# EAGLE design PC03 (EAGLE 9.6.2)
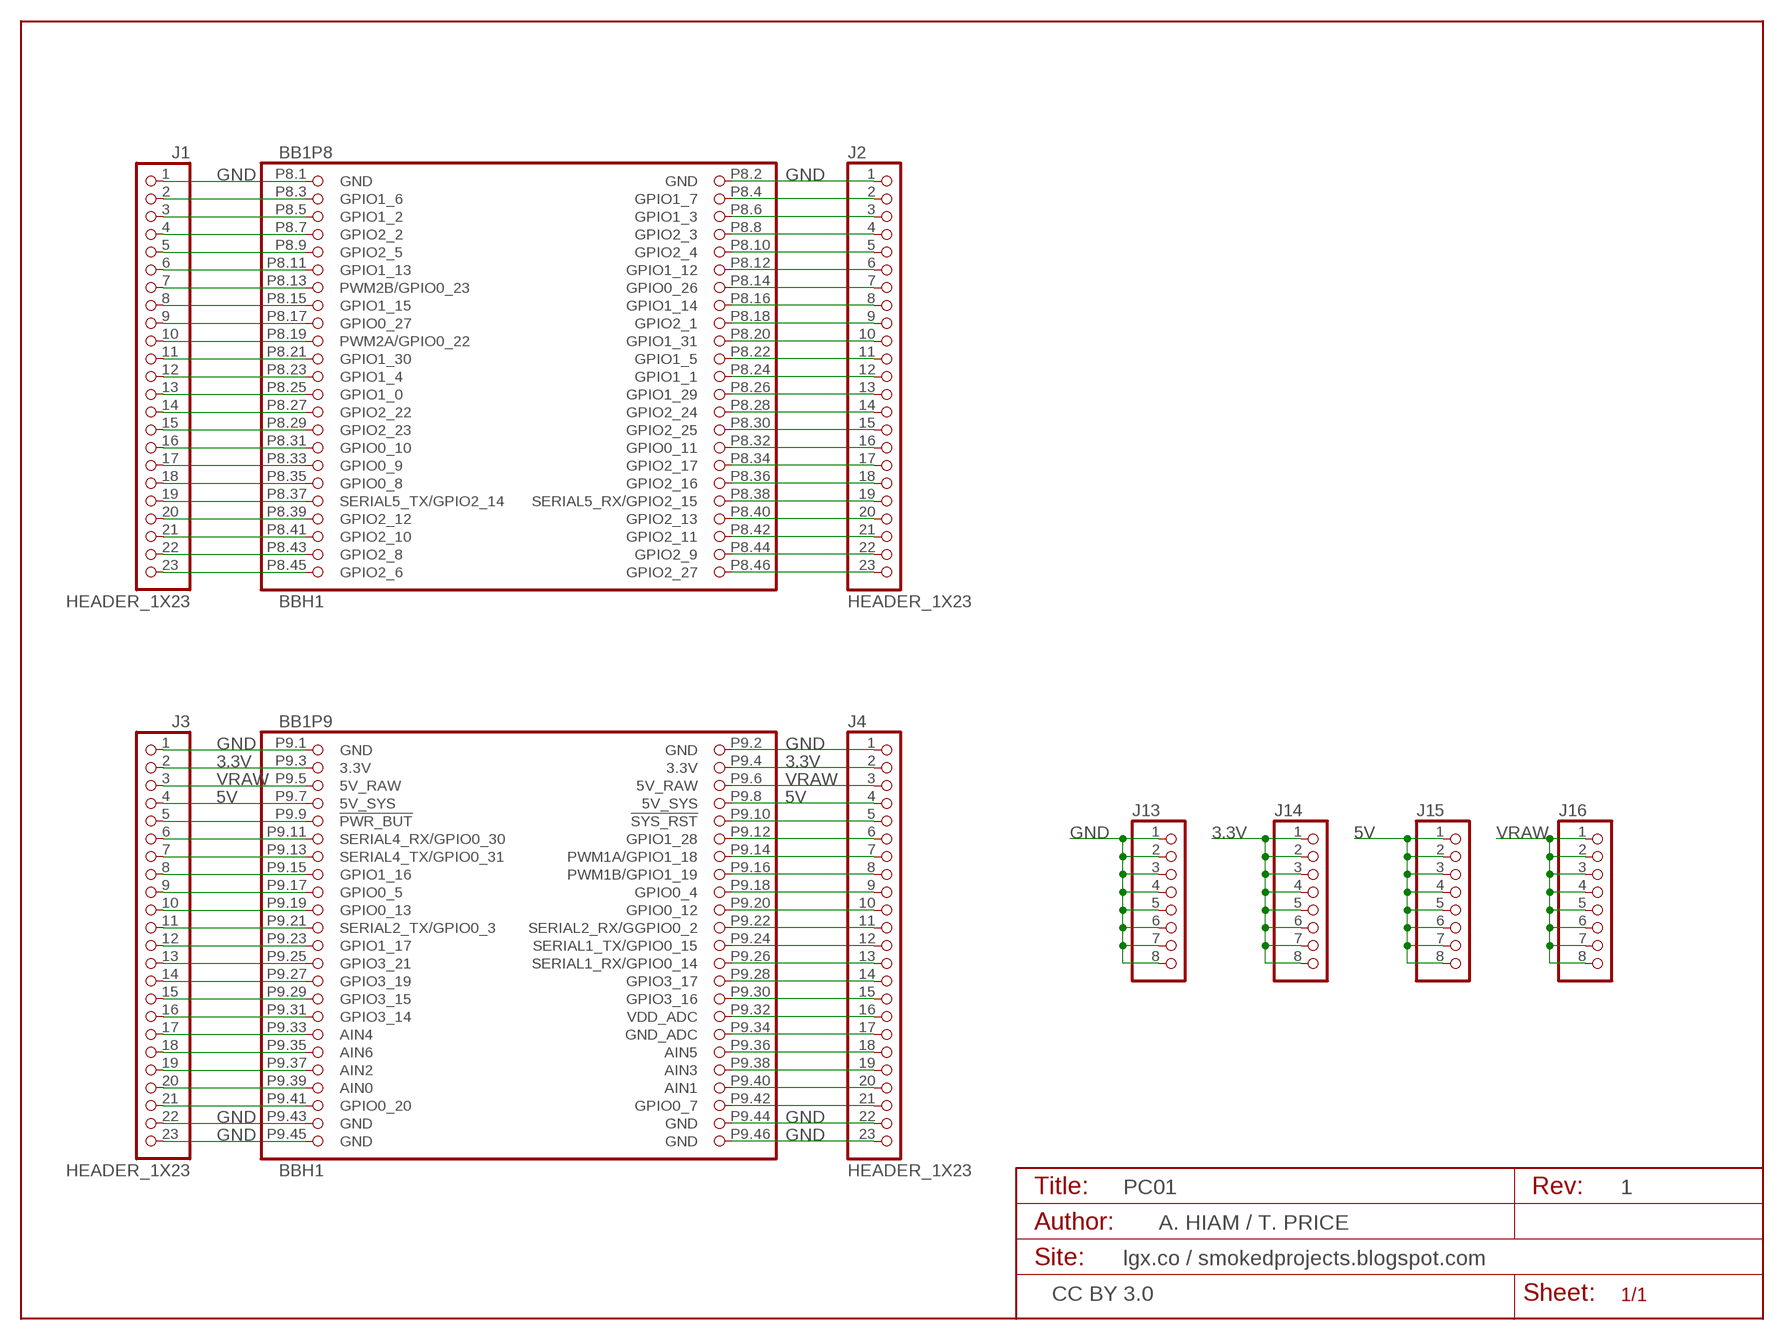
[diagram p0: schematic, sheet 1]

## Parts
BB1  BBH1  [BB_CAPE]
J1  HEADER_1X23  [HEADER_1X23]
J2  HEADER_1X23  [HEADER_1X23]
J3  HEADER_1X23  [HEADER_1X23]
J4  HEADER_1X23  [HEADER_1X23]
J13  HEADER_1X8  [HEADER_1X8]
J14  HEADER_1X8  [HEADER_1X8]
J15  HEADER_1X8  [HEADER_1X8]
J16  HEADER_1X8  [HEADER_1X8]

## Nets
3.3V: BB1.P9.3(P9:3.3V) BB1.P9.4(P9:3.3V) J3.2 J4.2 J14.1 J14.2 J14.3 J14.4 J14.5 J14.6 J14.7 J14.8
5V: BB1.P9.7(P9:5V_SYS) BB1.P9.8(P9:5V_SYS) J3.4 J4.4 J15.1 J15.2 J15.3 J15.4 J15.5 J15.6 J15.7 J15.8
GND: BB1.P8.1(P8:GND) BB1.P8.2(P8:GND) BB1.P9.1(P9:GND) BB1.P9.2(P9:GND) BB1.P9.43(P9:GND) BB1.P9.44(P9:GND) BB1.P9.45(P9:GND) BB1.P9.46(P9:GND) J1.1 J2.1 J3.1 J3.22 J3.23 J4.1 J4.22 J4.23 J13.1 J13.2 J13.3 J13.4 J13.5 J13.6 J13.7 J13.8
N$2: BB1.P8.4(P8:GPIO1_7) J2.2
N$3: BB1.P8.6(P8:GPIO1_3) J2.3
N$4: BB1.P8.8(P8:GPIO2_3) J2.4
N$5: BB1.P8.10(P8:GPIO2_4) J2.5
N$6: BB1.P8.12(P8:GPIO1_12) J2.6
N$7: BB1.P8.14(P8:GPIO0_26) J2.7
N$8: BB1.P8.16(P8:GPIO1_14) J2.8
N$9: BB1.P8.18(P8:GPIO2_1) J2.9
N$10: BB1.P8.20(P8:GPIO1_31) J2.10
N$11: BB1.P8.22(P8:GPIO1_5) J2.11
N$12: BB1.P8.24(P8:GPIO1_1) J2.12
N$13: BB1.P8.26(P8:GPIO1_29) J2.13
N$14: BB1.P8.28(P8:GPIO2_24) J2.14
N$15: BB1.P8.30(P8:GPIO2_25) J2.15
N$16: BB1.P8.32(P8:GPIO0_11) J2.16
N$17: BB1.P8.34(P8:GPIO2_17) J2.17
N$18: BB1.P8.36(P8:GPIO2_16) J2.18
N$19: BB1.P8.38(P8:SERIAL5_RX/GPIO2_15) J2.19
N$20: BB1.P8.40(P8:GPIO2_13) J2.20
N$21: BB1.P8.42(P8:GPIO2_11) J2.21
N$22: BB1.P8.44(P8:GPIO2_9) J2.22
N$23: BB1.P8.46(P8:GPIO2_27) J2.23
N$24: BB1.P8.45(P8:GPIO2_6) J1.23
N$25: BB1.P8.43(P8:GPIO2_8) J1.22
N$26: BB1.P8.41(P8:GPIO2_10) J1.21
N$27: BB1.P8.39(P8:GPIO2_12) J1.20
N$28: BB1.P8.37(P8:SERIAL5_TX/GPIO2_14) J1.19
N$29: BB1.P8.35(P8:GPIO0_8) J1.18
N$30: BB1.P8.33(P8:GPIO0_9) J1.17
N$31: BB1.P8.31(P8:GPIO0_10) J1.16
N$32: BB1.P8.29(P8:GPIO2_23) J1.15
N$33: BB1.P8.27(P8:GPIO2_22) J1.14
N$34: BB1.P8.25(P8:GPIO1_0) J1.13
N$35: BB1.P8.23(P8:GPIO1_4) J1.12
N$36: BB1.P8.21(P8:GPIO1_30) J1.11
N$37: BB1.P8.19(P8:PWM2A/GPIO0_22) J1.10
N$38: BB1.P8.17(P8:GPIO0_27) J1.9
N$39: BB1.P8.15(P8:GPIO1_15) J1.8
N$40: BB1.P8.13(P8:PWM2B/GPIO0_23) J1.7
N$41: BB1.P8.11(P8:GPIO1_13) J1.6
N$42: BB1.P8.9(P8:GPIO2_5) J1.5
N$43: BB1.P8.7(P8:GPIO2_2) J1.4
N$44: BB1.P8.5(P8:GPIO1_2) J1.3
N$45: BB1.P8.3(P8:GPIO1_6) J1.2
N$49: BB1.P9.41(P9:GPIO0_20) J3.21
N$50: BB1.P9.39(P9:AIN0) J3.20
N$51: BB1.P9.37(P9:AIN2) J3.19
N$52: BB1.P9.35(P9:AIN6) J3.18
N$53: BB1.P9.33(P9:AIN4) J3.17
N$54: BB1.P9.31(P9:GPIO3_14) J3.16
N$55: BB1.P9.29(P9:GPIO3_15) J3.15
N$56: BB1.P9.27(P9:GPIO3_19) J3.14
N$57: BB1.P9.25(P9:GPIO3_21) J3.13
N$58: BB1.P9.23(P9:GPIO1_17) J3.12
N$59: BB1.P9.21(P9:SERIAL2_TX/GPIO0_3) J3.11
N$60: BB1.P9.19(P9:GPIO0_13) J3.10
N$61: BB1.P9.17(P9:GPIO0_5) J3.9
N$62: BB1.P9.15(P9:GPIO1_16) J3.8
N$63: BB1.P9.13(P9:SERIAL4_TX/GPIO0_31) J3.7
N$64: BB1.P9.11(P9:SERIAL4_RX/GPIO0_30) J3.6
N$65: BB1.P9.9(P9:!PWR_BUT) J3.5
N$74: BB1.P9.10(P9:!SYS_RST) J4.5
N$75: BB1.P9.12(P9:GPIO1_28) J4.6
N$76: BB1.P9.14(P9:PWM1A/GPIO1_18) J4.7
N$77: BB1.P9.16(P9:PWM1B/GPIO1_19) J4.8
N$78: BB1.P9.18(P9:GPIO0_4) J4.9
N$79: BB1.P9.20(P9:GPIO0_12) J4.10
N$80: BB1.P9.22(P9:SERIAL2_RX/GGPIO0_2) J4.11
N$81: BB1.P9.24(P9:SERIAL1_TX/GPIO0_15) J4.12
N$82: BB1.P9.26(P9:SERIAL1_RX/GPIO0_14) J4.13
N$83: BB1.P9.28(P9:GPIO3_17) J4.14
N$84: BB1.P9.30(P9:GPIO3_16) J4.15
N$85: BB1.P9.32(P9:VDD_ADC) J4.16
N$86: BB1.P9.34(P9:GND_ADC) J4.17
N$87: BB1.P9.36(P9:AIN5) J4.18
N$88: BB1.P9.38(P9:AIN3) J4.19
N$89: BB1.P9.40(P9:AIN1) J4.20
N$90: BB1.P9.42(P9:GPIO0_7) J4.21
VRAW: BB1.P9.5(P9:5V_RAW) BB1.P9.6(P9:5V_RAW) J3.3 J4.3 J16.1 J16.2 J16.3 J16.4 J16.5 J16.6 J16.7 J16.8

## Notes on the sheet
- PC01 | 1
- A. HIAM / T. PRICE
- lgx.co / smokedprojects.blogspot.com
- CC BY 3.0

## Library data of the parts
BB1 = logic-supply:BBH: BeagleBone header sub-assembly; PARTNO: BBH1
J1-J4 = logic-supply:HEADER_1X23
J13-J16 = logic-supply:HEADER_1X8

## Board
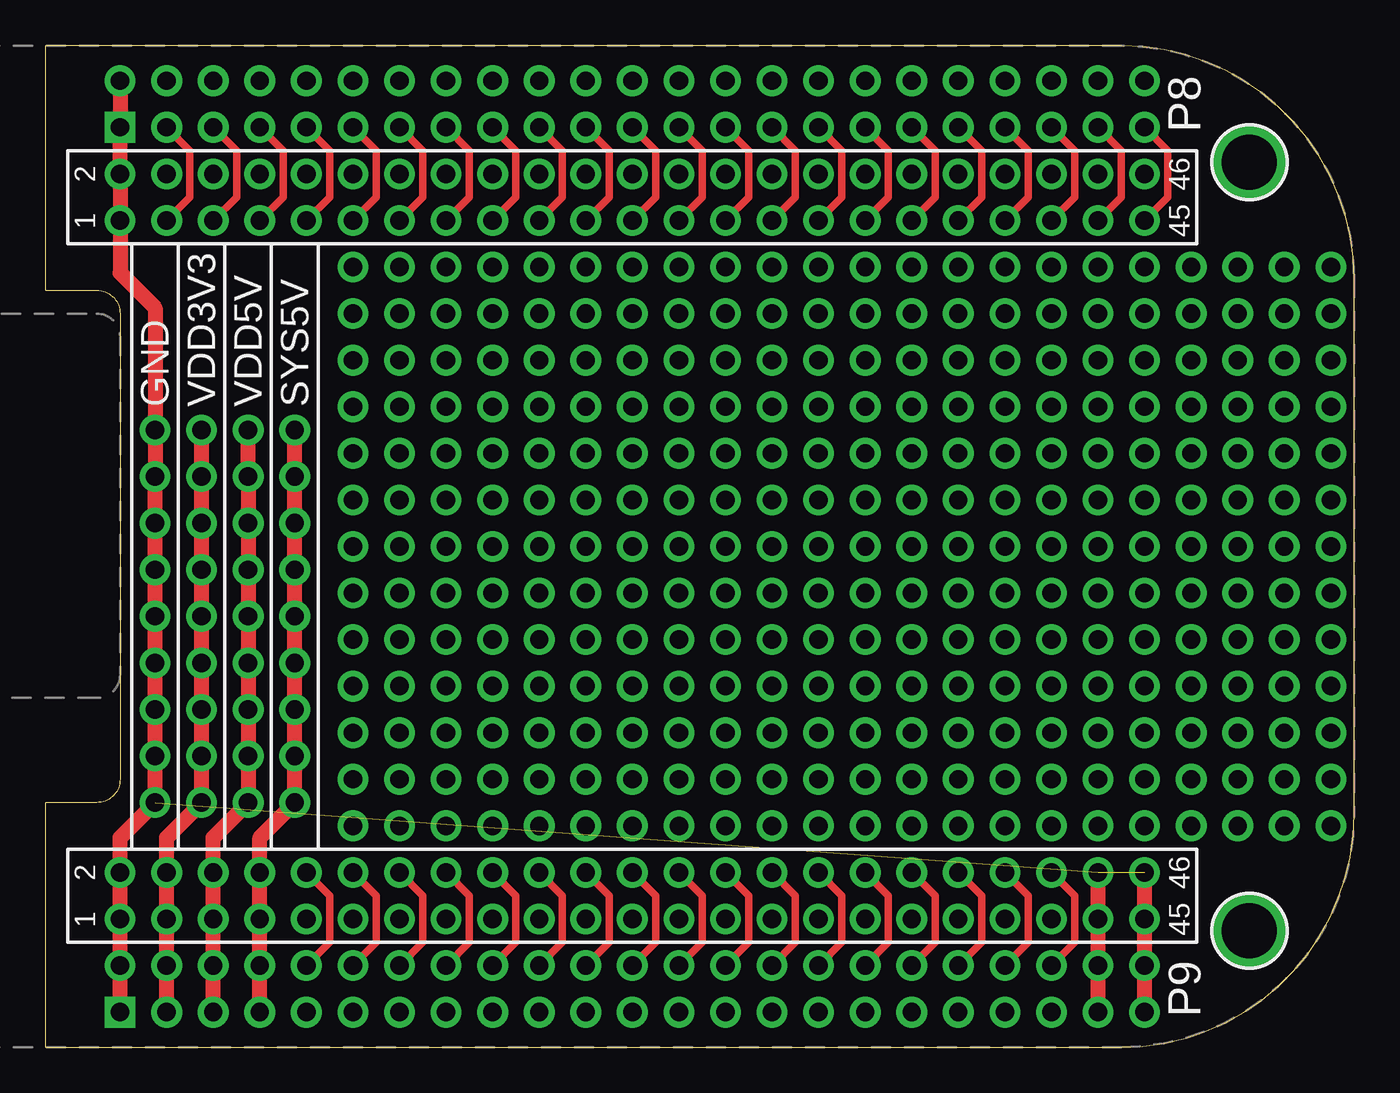
[diagram p1: board, top side]
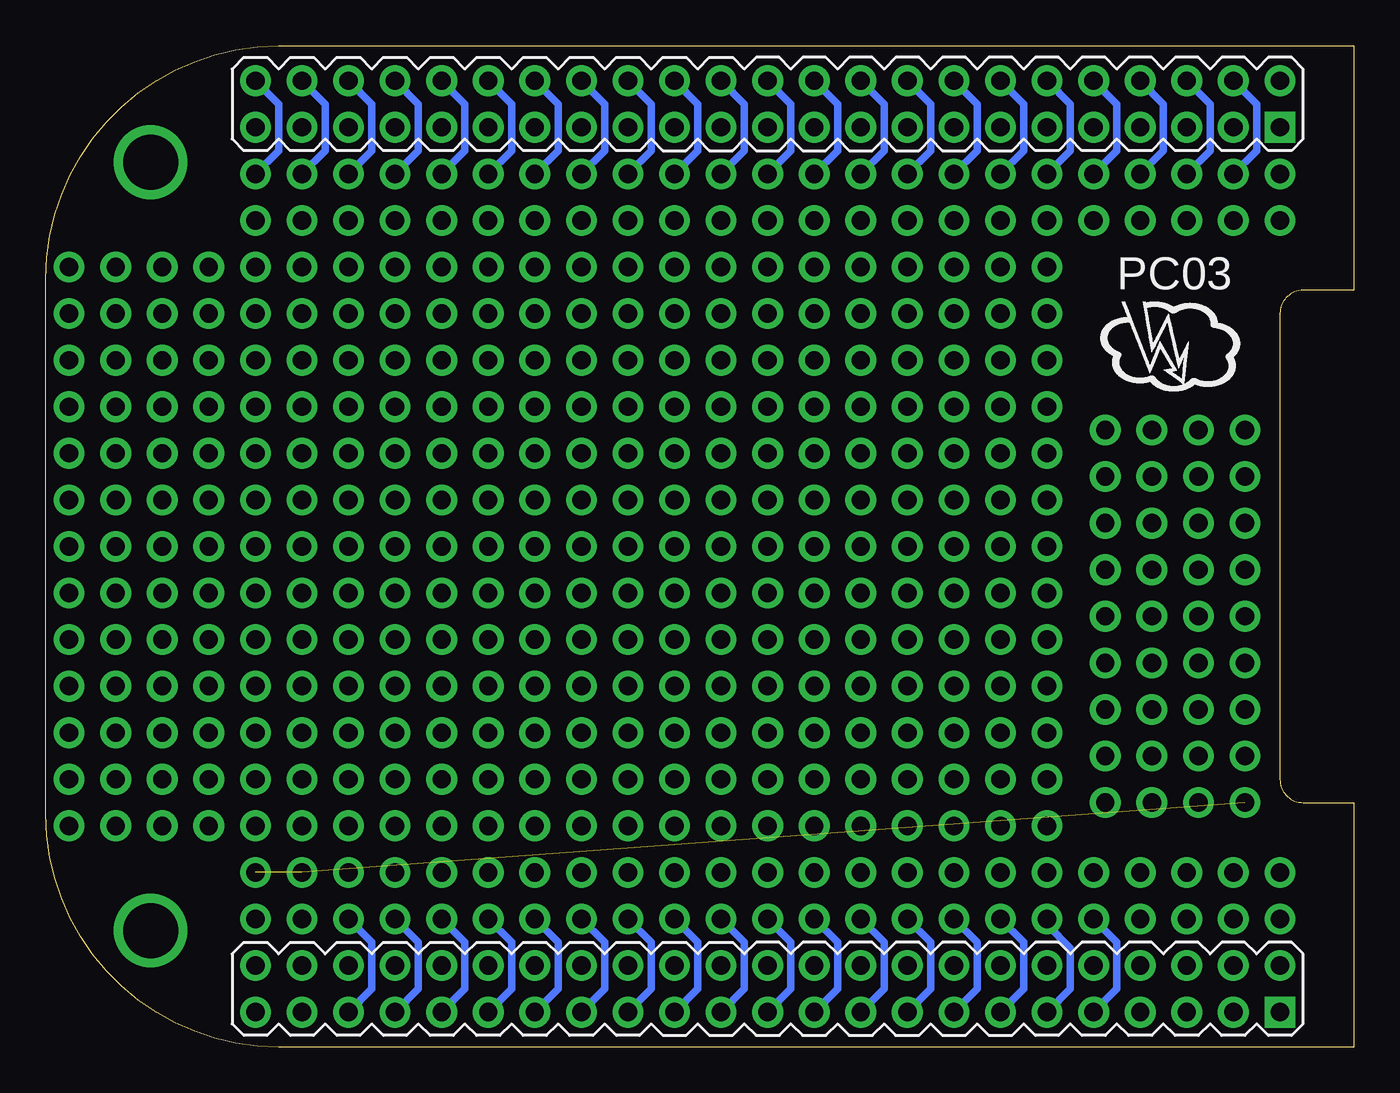
[diagram p2: board, bottom side, seen from below]

Size 71.36 x 54.61 mm. Coordinates in mm from the lower left corner, seen from the top.
Outline: 2.78,41.27 arc-90 4.05,40.01 4.05,14.61 arc-90 2.78,13.34 0,13.34 0,0 58.66,0 arc90 71.36,12.7 71.36,41.91 arc90 58.66,54.61 0,54.61 0,41.27 2.78,41.27
Outline: 2.78,41.27 2.79,41.27
Copper layers (1*16): Top 0.035mm / dielectric 1.5mm / Bottom 0.035mm
Design rules "Fusion_eagle_rule_v1.1": minimum track width 6mil, minimum drill 12mil, track to track 6mil, track to pad 6mil, pad to pad 6mil, via to via 6mil, smd to smd 0mil, copper to edge 10mil, drill to drill 10mil, minimum pad ring 10mil, minimum via ring 6mil, stop-mask expansion 2mil, vias tented up to drill 100mil, thermal gap 10mil

### Footprints (pad centres in the part's own frame; a part is rotated, then mirrored left to right if it is on the bottom)
BB_CAPE = drill 1 pad 1.676 square: P8.1 4.445,19.05; P9.1 52.705,19.05 | drill 1 pad 1.676: P8.2 1.905,19.05; P8.3 4.445,21.59; P8.4 1.905,21.59; P8.5 4.445,24.13; P8.6 1.905,24.13; P8.7 4.445,26.67; P8.8 1.905,26.67; P8.9 4.445,29.21; P8.10 1.905,29.21; P8.11 4.445,31.75; P8.12 1.905,31.75; P8.13 4.445,34.29; P8.14 1.905,34.29; P8.15 4.445,36.83; P8.16 1.905,36.83; P8.17 4.445,39.37; P8.18 1.905,39.37; P8.19 4.445,41.91; P8.20 1.905,41.91; P8.21 4.445,44.45; P8.22 1.905,44.45; P8.23 4.445,46.99; P8.24 1.905,46.99; P8.25 4.445,49.53; P8.26 1.905,49.53; P8.27 4.445,52.07; P8.28 1.905,52.07; P8.29 4.445,54.61; P8.30 1.905,54.61; P8.31 4.445,57.15; P8.32 1.905,57.15; P8.33 4.445,59.69; P8.34 1.905,59.69; P8.35 4.445,62.23; P8.36 1.905,62.23; P8.37 4.445,64.77; P8.38 1.905,64.77; P8.39 4.445,67.31; P8.40 1.905,67.31; P8.41 4.445,69.85; P8.42 1.905,69.85; P8.43 4.445,72.39; P8.44 1.905,72.39; P8.45 4.445,74.93; P8.46 1.905,74.93; P9.2 50.165,19.05; P9.3 52.705,21.59; P9.4 50.165,21.59; P9.5 52.705,24.13; P9.6 50.165,24.13; P9.7 52.705,26.67; P9.8 50.165,26.67; P9.9 52.705,29.21; P9.10 50.165,29.21; P9.11 52.705,31.75; P9.12 50.165,31.75; P9.13 52.705,34.29; P9.14 50.165,34.29; P9.15 52.705,36.83; P9.16 50.165,36.83; P9.17 52.705,39.37; P9.18 50.165,39.37; P9.19 52.705,41.91; P9.20 50.165,41.91; P9.21 52.705,44.45; P9.22 50.165,44.45; P9.23 52.705,46.99; P9.24 50.165,46.99; P9.25 52.705,49.53; P9.26 50.165,49.53; P9.27 52.705,52.07; P9.28 50.165,52.07; P9.29 52.705,54.61; P9.30 50.165,54.61; P9.31 52.705,57.15; P9.32 50.165,57.15; P9.33 52.705,59.69; P9.34 50.165,59.69; P9.35 52.705,62.23; P9.36 50.165,62.23; P9.37 52.705,64.77; P9.38 50.165,64.77; P9.39 52.705,67.31; P9.40 50.165,67.31; P9.41 52.705,69.85; P9.42 50.165,69.85; P9.43 52.705,72.39; P9.44 50.165,72.39; P9.45 52.705,74.93; P9.46 50.165,74.93
HEADER_1X23 = drill 1 pad 1.676: 1 -27.94,0; 2 -25.4,0; 3 -22.86,0; 4 -20.32,0; 5 -17.78,0; 6 -15.24,0; 7 -12.7,0; 8 -10.16,0; 9 -7.62,0; 10 -5.08,0; 11 -2.54,0; 12 0,0; 13 2.54,0; 14 5.08,0; 15 7.62,0; 16 10.16,0; 17 12.7,0; 18 15.24,0; 19 17.78,0; 20 20.32,0; 21 22.86,0; 22 25.4,0; 23 27.94,0
HEADER_1X8 = drill 1 pad 1.676: 1 -8.89,0; 2 -6.35,0; 3 -3.81,0; 4 -1.27,0; 5 1.27,0; 6 3.81,0; 7 6.35,0; 8 8.89,0
MOUNTINGHOLE_3.0_PLATEDTHIN = drill 3 pad 3.6: P$1 0,0

### Placement (x,y rotation side)
BB1  -15,54.61 270 top
J1  31.99,45.09 0 top
J2  31.99,47.62 0 top
J3  31.99,6.99 0 top
J4  31.99,9.53 0 top
J13  5.96,22.23 270 top
J14  8.49,22.23 270 top
J15  13.57,22.23 270 top
J16  11.04,22.23 270 top
U$1  [MOUNTINGHOLE_3.0_PLATEDTHIN]  65.64,48.26 0 top
U$3  [MOUNTINGHOLE_3.0_PLATEDTHIN]  65.64,6.35 0 top

### Tracks (layer width: path | path; a pad name or v marks a point on that pad's centre or on a via)
3.3V  (via drill 1 pad 1.68)
  Top 0.813: BB1.P9.3 BB1.P9.4 J3.2 J4.2 6.59,11.43 J14.8 J14.7 J14.6 J14.5 J14.4 J14.3 J14.2 J14.1 v8.49,33.66
5V  (via drill 1 pad 1.68)
  Top 0.813: BB1.P9.7 BB1.P9.8 J3.4 J4.4 11.67,11.43 J15.8 J15.7 J15.6 J15.5 J15.4 J15.3 J15.2 J15.1 v13.57,33.66
GND  (via drill 1 pad 1.68)  (2 unrouted)
  Top 0.813: BB1.P9.1 BB1.P9.2 J3.1 J4.1 4.05,11.43 J13.8 J13.7 J13.6 J13.5 J13.4 J13.3 J13.2 J13.1 v5.96,33.66 5.96,40.32 4.05,42.23 J1.1 J2.1 BB1.P8.1 BB1.P8.2 | BB1.P9.43 BB1.P9.44 J3.22 J4.22 | BB1.P9.45 BB1.P9.46 J3.23 J4.23
N$1  (via drill 1 pad 1.68)
  other vias: 19.29,34.92
N$2
  Bottom 0.406: J2.2 5.32,48.9 5.32,51.44 BB1.P8.4
N$3
  Bottom 0.406: J2.3 7.86,48.9 7.86,51.44 BB1.P8.6
N$4
  Bottom 0.406: BB1.P8.8 10.4,51.44 10.4,48.9 J2.4
N$5
  Bottom 0.406: BB1.P8.10 12.94,51.44 12.94,48.9 J2.5
N$6
  Bottom 0.406: BB1.P8.12 15.48,51.44 15.48,48.9 J2.6
N$7
  Bottom 0.406: BB1.P8.14 18.02,51.44 18.02,48.9 J2.7
N$8
  Bottom 0.406: BB1.P8.16 20.56,51.44 20.56,48.9 J2.8
N$9
  Bottom 0.406: BB1.P8.18 23.1,51.44 23.1,48.9 J2.9
N$10
  Bottom 0.406: BB1.P8.20 25.64,51.44 25.64,48.9 J2.10
N$11
  Bottom 0.406: BB1.P8.22 28.18,51.44 28.18,48.9 J2.11
N$12
  Bottom 0.406: BB1.P8.24 30.72,51.44 30.72,48.9 J2.12
N$13
  Bottom 0.406: BB1.P8.26 33.26,51.44 33.26,48.9 J2.13
N$14
  Bottom 0.406: BB1.P8.28 35.8,51.44 35.8,48.9 J2.14
N$15
  Bottom 0.406: BB1.P8.30 38.34,51.44 38.34,48.9 J2.15
N$16
  Bottom 0.406: BB1.P8.32 40.88,51.44 40.88,48.9 J2.16
N$17
  Bottom 0.406: BB1.P8.34 43.42,51.44 43.42,48.9 J2.17
N$18
  Bottom 0.406: BB1.P8.36 45.96,51.44 45.96,48.9 J2.18
N$19
  Bottom 0.406: BB1.P8.38 48.5,51.44 48.5,48.9 J2.19
N$20
  Bottom 0.406: BB1.P8.40 51.04,51.44 51.04,48.9 J2.20
N$21
  Bottom 0.406: BB1.P8.42 53.58,51.44 53.58,48.9 J2.21
N$22
  Bottom 0.406: BB1.P8.44 56.12,51.44 56.12,48.9 J2.22
N$23
  Bottom 0.406: BB1.P8.46 58.66,51.44 58.66,48.9 J2.23
N$24
  Top 0.406: J1.23 61.2,46.35 61.2,48.9 BB1.P8.45
N$25
  Top 0.406: J1.22 58.66,46.35 58.66,48.9 BB1.P8.43
N$26
  Top 0.406: J1.21 56.12,46.35 56.12,48.9 BB1.P8.41
N$27
  Top 0.406: J1.20 53.58,46.35 53.58,48.9 BB1.P8.39
N$28
  Top 0.406: J1.19 51.04,46.35 51.04,48.9 BB1.P8.37
N$29
  Top 0.406: J1.18 48.5,46.35 48.5,48.9 BB1.P8.35
N$30
  Top 0.406: J1.17 45.96,46.35 45.96,48.9 BB1.P8.33
N$31
  Top 0.406: J1.16 43.42,46.35 43.42,48.9 BB1.P8.31
N$32
  Top 0.406: J1.15 40.88,46.35 40.88,48.9 BB1.P8.29
N$33
  Top 0.406: J1.14 38.34,46.35 38.34,48.9 BB1.P8.27
N$34
  Top 0.406: J1.13 35.8,46.35 35.8,48.9 BB1.P8.25
N$35
  Top 0.406: J1.12 33.26,46.35 33.26,48.9 BB1.P8.23
N$36
  Top 0.406: J1.11 30.72,46.35 30.72,48.9 BB1.P8.21
N$37
  Top 0.406: J1.10 28.18,46.35 28.18,48.9 BB1.P8.19
N$38
  Top 0.406: J1.9 25.64,46.35 25.64,48.9 BB1.P8.17
N$39
  Top 0.406: J1.8 23.1,46.35 23.1,48.9 BB1.P8.15
N$40
  Top 0.406: J1.7 20.56,46.35 20.56,48.9 BB1.P8.13
N$41
  Top 0.406: J1.6 18.02,46.35 18.02,48.9 BB1.P8.11
N$42
  Top 0.406: J1.5 15.48,46.35 15.48,48.9 BB1.P8.9
N$43
  Top 0.406: J1.4 12.94,46.35 12.94,48.9 BB1.P8.7
N$44
  Top 0.406: J1.3 10.4,46.35 10.4,48.9 BB1.P8.5
N$45
  Top 0.406: J1.2 7.86,46.35 7.86,48.9 BB1.P8.3
N$46  (via drill 1 pad 1.68)
  other vias: 19.29,32.38
N$47  (via drill 1 pad 1.68)
  other vias: 19.29,29.84
N$48  (via drill 1 pad 1.68)
  other vias: 19.29,27.3
N$49
  Bottom 0.406: J3.21 53.58,5.71 53.58,3.17 BB1.P9.41
N$50
  Bottom 0.406: J3.20 51.04,5.71 51.04,3.17 BB1.P9.39
N$51
  Bottom 0.406: J3.19 48.5,5.71 48.5,3.17 BB1.P9.37
N$52
  Bottom 0.406: J3.18 45.96,5.71 45.96,3.17 BB1.P9.35
N$53
  Bottom 0.406: J3.17 43.42,5.71 43.42,3.17 BB1.P9.33
N$54
  Bottom 0.406: J3.16 40.88,5.71 40.88,3.17 BB1.P9.31
N$55
  Bottom 0.406: J3.15 38.34,5.71 38.34,3.17 BB1.P9.29
N$56
  Bottom 0.406: J3.14 35.8,5.71 35.8,3.17 BB1.P9.27
N$57
  Bottom 0.406: J3.13 33.26,5.71 33.26,3.17 BB1.P9.25
N$58
  Bottom 0.406: J3.12 30.72,5.71 30.72,3.17 BB1.P9.23
N$59
  Bottom 0.406: J3.11 28.18,5.71 28.18,3.17 BB1.P9.21
N$60
  Bottom 0.406: J3.10 25.64,5.71 25.64,3.17 BB1.P9.19
N$61
  Bottom 0.406: J3.9 23.1,5.71 23.1,3.17 BB1.P9.17
N$62
  Bottom 0.406: J3.8 20.56,5.71 20.56,3.17 BB1.P9.15
N$63
  Bottom 0.406: J3.7 18.02,5.71 18.02,3.17 BB1.P9.13
N$64
  Bottom 0.406: J3.6 16.75,6.67 15.48,5.4 15.48,3.17 BB1.P9.11
N$65
  Bottom 0.406: J3.5 12.94,5.71 12.94,3.17 BB1.P9.9
N$66  (via drill 1 pad 1.68)
  other vias: 59.93,42.55
N$67  (via drill 1 pad 1.68)
  other vias: 57.39,42.55
N$68  (via drill 1 pad 1.68)
  other vias: 54.85,42.55
N$69  (via drill 1 pad 1.68)
  other vias: 52.31,42.55
N$70  (via drill 1 pad 1.68)
  other vias: 49.77,42.55
N$71  (via drill 1 pad 1.68)
  other vias: 47.23,42.55
N$72  (via drill 1 pad 1.68)
  other vias: 44.69,42.55
N$73  (via drill 1 pad 1.68)
  other vias: 42.15,42.55
N$74
  Top 0.406: J4.5 15.48,8.26 15.48,5.71 BB1.P9.10
N$75
  Top 0.406: J4.6 18.02,8.26 18.02,5.71 BB1.P9.12
N$76
  Top 0.406: J4.7 20.56,8.26 20.56,5.71 BB1.P9.14
N$77
  Top 0.406: J4.8 23.1,8.26 23.1,5.71 BB1.P9.16
N$78
  Top 0.406: J4.9 25.64,8.26 25.64,5.71 BB1.P9.18
N$79
  Top 0.406: J4.10 28.18,8.26 28.18,5.71 BB1.P9.20
N$80
  Top 0.406: J4.11 30.72,8.26 30.72,5.71 BB1.P9.22
N$81
  Top 0.406: J4.12 33.26,8.26 33.26,5.71 BB1.P9.24
N$82
  Top 0.406: J4.13 35.8,8.26 35.8,5.71 BB1.P9.26
N$83
  Top 0.406: J4.14 38.34,8.26 38.34,5.71 BB1.P9.28
N$84
  Top 0.406: J4.15 40.88,8.26 40.88,5.71 BB1.P9.30
N$85
  Top 0.406: J4.16 43.42,8.26 43.42,5.71 BB1.P9.32
N$86
  Top 0.406: J4.17 45.96,8.26 45.96,5.71 BB1.P9.34
N$87
  Top 0.406: J4.18 48.5,8.26 48.5,5.71 BB1.P9.36
N$88
  Top 0.406: J4.19 51.04,8.26 51.04,5.71 BB1.P9.38
N$89
  Top 0.406: J4.20 53.58,8.26 53.58,5.71 BB1.P9.40
N$90
  Top 0.406: J4.21 56.12,8.26 56.12,5.71 BB1.P9.42
N$91  (via drill 1 pad 1.68)
  other vias: 19.29,24.77
N$92  (via drill 1 pad 1.68)
  other vias: 19.29,22.23
N$105  (via drill 1 pad 1.68)
  other vias: 39.61,42.55
N$106  (via drill 1 pad 1.68)
  other vias: 37.07,42.55
N$107  (via drill 1 pad 1.68)
  other vias: 34.53,42.55
N$108  (via drill 1 pad 1.68)
  other vias: 31.99,42.55
N$109  (via drill 1 pad 1.68)
  other vias: 29.45,42.55
N$110  (via drill 1 pad 1.68)
  other vias: 26.91,42.55
N$111  (via drill 1 pad 1.68)
  other vias: 24.37,42.55
N$112  (via drill 1 pad 1.68)
  other vias: 21.83,42.55
N$113  (via drill 1 pad 1.68)
  other vias: 19.29,42.55
N$114  (via drill 1 pad 1.68)
  other vias: 16.75,42.55
N$115  (via drill 1 pad 1.68)
  other vias: 19.29,19.68
N$116  (via drill 1 pad 1.68)
  other vias: 26.91,17.14
N$117  (via drill 1 pad 1.68)
  other vias: 29.45,17.14
N$118  (via drill 1 pad 1.68)
  other vias: 31.99,19.68
N$119  (via drill 1 pad 1.68)
  other vias: 31.99,22.23
N$120  (via drill 1 pad 1.68)
  other vias: 31.99,24.77
N$121  (via drill 1 pad 1.68)
  other vias: 31.99,27.3
N$122  (via drill 1 pad 1.68)
  other vias: 31.99,29.84
N$123  (via drill 1 pad 1.68)
  other vias: 31.99,32.38
N$124  (via drill 1 pad 1.68)
  other vias: 16.75,40.01
N$125  (via drill 1 pad 1.68)
  other vias: 19.29,40.01
N$126  (via drill 1 pad 1.68)
  other vias: 21.83,40.01
N$127  (via drill 1 pad 1.68)
  other vias: 24.37,40.01
N$128  (via drill 1 pad 1.68)
  other vias: 26.91,40.01
N$129  (via drill 1 pad 1.68)
  other vias: 29.45,40.01
N$130  (via drill 1 pad 1.68)
  other vias: 31.99,40.01
N$131  (via drill 1 pad 1.68)
  other vias: 34.53,40.01
N$132  (via drill 1 pad 1.68)
  other vias: 37.07,40.01
N$133  (via drill 1 pad 1.68)
  other vias: 39.61,40.01
N$134  (via drill 1 pad 1.68)
  other vias: 42.15,40.01
N$135  (via drill 1 pad 1.68)
  other vias: 44.69,40.01
N$136  (via drill 1 pad 1.68)
  other vias: 47.23,40.01
N$137  (via drill 1 pad 1.68)
  other vias: 49.77,40.01
N$138  (via drill 1 pad 1.68)
  other vias: 52.31,40.01
N$139  (via drill 1 pad 1.68)
  other vias: 54.85,40.01
N$140  (via drill 1 pad 1.68)
  other vias: 57.39,40.01
N$141  (via drill 1 pad 1.68)
  other vias: 59.93,40.01
N$142  (via drill 1 pad 1.68)
  other vias: 31.99,34.92
N$143  (via drill 1 pad 1.68)
  other vias: 70.09,12.06
N$144  (via drill 1 pad 1.68)
  other vias: 70.09,14.61
N$145  (via drill 1 pad 1.68)
  other vias: 70.09,17.14
N$146  (via drill 1 pad 1.68)
  other vias: 70.09,19.68
N$147  (via drill 1 pad 1.68)
  other vias: 70.09,22.23
N$148  (via drill 1 pad 1.68)
  other vias: 70.09,24.77
N$149  (via drill 1 pad 1.68)
  other vias: 24.37,22.23
N$150  (via drill 1 pad 1.68)
  other vias: 24.37,19.68
N$151  (via drill 1 pad 1.68)
  other vias: 16.75,12.06
N$152  (via drill 1 pad 1.68)
  other vias: 16.75,14.61
N$153  (via drill 1 pad 1.68)
  other vias: 19.29,17.14
N$154  (via drill 1 pad 1.68)
  other vias: 24.37,24.77
N$155  (via drill 1 pad 1.68)
  other vias: 24.37,27.3
N$156  (via drill 1 pad 1.68)
  other vias: 24.37,29.84
N$157  (via drill 1 pad 1.68)
  other vias: 24.37,32.38
N$158  (via drill 1 pad 1.68)
  other vias: 24.37,34.92
N$159  (via drill 1 pad 1.68)
  other vias: 19.29,37.47
N$160  (via drill 1 pad 1.68)
  other vias: 21.83,37.47
N$161  (via drill 1 pad 1.68)
  other vias: 21.83,34.92
N$162  (via drill 1 pad 1.68)
  other vias: 21.83,32.38
N$163  (via drill 1 pad 1.68)
  other vias: 21.83,29.84
N$164  (via drill 1 pad 1.68)
  other vias: 21.83,27.3
N$165  (via drill 1 pad 1.68)
  other vias: 21.83,24.77
N$166  (via drill 1 pad 1.68)
  other vias: 21.83,22.23
N$167  (via drill 1 pad 1.68)
  other vias: 21.83,19.68
N$168  (via drill 1 pad 1.68)
  other vias: 21.83,17.14
N$169  (via drill 1 pad 1.68)
  other vias: 19.29,14.61
N$170  (via drill 1 pad 1.68)
  other vias: 19.29,12.06
N$171  (via drill 1 pad 1.68)
  other vias: 24.37,37.47
N$172  (via drill 1 pad 1.68)
  other vias: 70.09,27.3
N$173  (via drill 1 pad 1.68)
  other vias: 70.09,29.84
N$174  (via drill 1 pad 1.68)
  other vias: 70.09,32.38
N$175  (via drill 1 pad 1.68)
  other vias: 70.09,34.92
N$176  (via drill 1 pad 1.68)
  other vias: 70.09,37.47
N$177  (via drill 1 pad 1.68)
  other vias: 70.09,42.55
N$178  (via drill 1 pad 1.68)
  other vias: 70.09,40.01
N$179  (via drill 1 pad 1.68)
  other vias: 24.37,17.14
N$180  (via drill 1 pad 1.68)
  other vias: 21.83,14.61
N$181  (via drill 1 pad 1.68)
  other vias: 21.83,12.06
N$182  (via drill 1 pad 1.68)
  other vias: 24.37,12.06
N$183  (via drill 1 pad 1.68)
  other vias: 24.37,14.61
N$185  (via drill 1 pad 1.68)
  other vias: 26.91,19.68
N$186  (via drill 1 pad 1.68)
  other vias: 26.91,22.23
N$187  (via drill 1 pad 1.68)
  other vias: 26.91,24.77
N$188  (via drill 1 pad 1.68)
  other vias: 26.91,27.3
N$189  (via drill 1 pad 1.68)
  other vias: 26.91,29.84
N$190  (via drill 1 pad 1.68)
  other vias: 26.91,32.38
N$191  (via drill 1 pad 1.68)
  other vias: 26.91,34.92
N$192  (via drill 1 pad 1.68)
  other vias: 26.91,37.47
N$193  (via drill 1 pad 1.68)
  other vias: 29.45,37.47
N$194  (via drill 1 pad 1.68)
  other vias: 29.45,34.92
N$195  (via drill 1 pad 1.68)
  other vias: 29.45,32.38
N$196  (via drill 1 pad 1.68)
  other vias: 29.45,29.84
N$197  (via drill 1 pad 1.68)
  other vias: 29.45,27.3
N$198  (via drill 1 pad 1.68)
  other vias: 29.45,24.77
N$199  (via drill 1 pad 1.68)
  other vias: 29.45,22.23
N$200  (via drill 1 pad 1.68)
  other vias: 29.45,19.68
N$202  (via drill 1 pad 1.68)
  other vias: 26.91,14.61
N$203  (via drill 1 pad 1.68)
  other vias: 26.91,12.06
N$204  (via drill 1 pad 1.68)
  other vias: 29.45,12.06
N$205  (via drill 1 pad 1.68)
  other vias: 29.45,14.61
N$206  (via drill 1 pad 1.68)
  other vias: 31.99,17.14
N$207  (via drill 1 pad 1.68)
  other vias: 37.07,19.68
N$208  (via drill 1 pad 1.68)
  other vias: 37.07,22.23
N$209  (via drill 1 pad 1.68)
  other vias: 37.07,24.77
N$210  (via drill 1 pad 1.68)
  other vias: 37.07,27.3
N$211  (via drill 1 pad 1.68)
  other vias: 37.07,29.84
N$212  (via drill 1 pad 1.68)
  other vias: 37.07,32.38
N$213  (via drill 1 pad 1.68)
  other vias: 37.07,34.92
N$214  (via drill 1 pad 1.68)
  other vias: 31.99,37.47
N$215  (via drill 1 pad 1.68)
  other vias: 34.53,37.47
N$216  (via drill 1 pad 1.68)
  other vias: 34.53,34.92
N$217  (via drill 1 pad 1.68)
  other vias: 34.53,32.38
N$218  (via drill 1 pad 1.68)
  other vias: 34.53,29.84
N$219  (via drill 1 pad 1.68)
  other vias: 34.53,27.3
N$220  (via drill 1 pad 1.68)
  other vias: 34.53,24.77
N$221  (via drill 1 pad 1.68)
  other vias: 34.53,22.23
N$222  (via drill 1 pad 1.68)
  other vias: 34.53,19.68
N$223  (via drill 1 pad 1.68)
  other vias: 34.53,17.14
N$224  (via drill 1 pad 1.68)
  other vias: 31.99,14.61
N$225  (via drill 1 pad 1.68)
  other vias: 31.99,12.06
N$226  (via drill 1 pad 1.68)
  other vias: 34.53,12.06
N$227  (via drill 1 pad 1.68)
  other vias: 34.53,14.61
N$228  (via drill 1 pad 1.68)
  other vias: 37.07,17.14
N$236  (via drill 1 pad 1.68)
  other vias: 37.07,37.47
N$237  (via drill 1 pad 1.68)
  other vias: 16.75,37.47
N$238  (via drill 1 pad 1.68)
  other vias: 16.75,34.92
N$239  (via drill 1 pad 1.68)
  other vias: 16.75,32.38
N$240  (via drill 1 pad 1.68)
  other vias: 16.75,29.84
N$241  (via drill 1 pad 1.68)
  other vias: 16.75,27.3
N$242  (via drill 1 pad 1.68)
  other vias: 16.75,24.77
N$243  (via drill 1 pad 1.68)
  other vias: 16.75,22.23
N$244  (via drill 1 pad 1.68)
  other vias: 16.75,19.68
N$245  (via drill 1 pad 1.68)
  other vias: 16.75,17.14
N$246  (via drill 1 pad 1.68)
  other vias: 37.07,14.61
N$247  (via drill 1 pad 1.68)
  other vias: 37.07,12.06
N$248  (via drill 1 pad 1.68)
  other vias: 39.61,12.06
N$249  (via drill 1 pad 1.68)
  other vias: 39.61,14.61
N$250  (via drill 1 pad 1.68)
  other vias: 39.61,17.14
N$251  (via drill 1 pad 1.68)
  other vias: 39.61,19.68
N$252  (via drill 1 pad 1.68)
  other vias: 39.61,22.23
N$253  (via drill 1 pad 1.68)
  other vias: 39.61,24.77
N$254  (via drill 1 pad 1.68)
  other vias: 39.61,27.3
N$255  (via drill 1 pad 1.68)
  other vias: 39.61,29.84
N$256  (via drill 1 pad 1.68)
  other vias: 39.61,32.38
N$257  (via drill 1 pad 1.68)
  other vias: 39.61,34.92
N$258  (via drill 1 pad 1.68)
  other vias: 39.61,37.47
N$259  (via drill 1 pad 1.68)
  other vias: 42.15,37.47
N$260  (via drill 1 pad 1.68)
  other vias: 42.15,34.92
N$261  (via drill 1 pad 1.68)
  other vias: 42.15,32.38
N$262  (via drill 1 pad 1.68)
  other vias: 42.15,29.84
N$263  (via drill 1 pad 1.68)
  other vias: 42.15,27.3
N$264  (via drill 1 pad 1.68)
  other vias: 42.15,24.77
N$265  (via drill 1 pad 1.68)
  other vias: 42.15,22.23
N$266  (via drill 1 pad 1.68)
  other vias: 42.15,19.68
N$267  (via drill 1 pad 1.68)
  other vias: 42.15,17.14
N$268  (via drill 1 pad 1.68)
  other vias: 42.15,14.61
N$269  (via drill 1 pad 1.68)
  other vias: 42.15,12.06
N$270  (via drill 1 pad 1.68)
  other vias: 44.69,12.06
N$271  (via drill 1 pad 1.68)
  other vias: 44.69,14.61
N$272  (via drill 1 pad 1.68)
  other vias: 44.69,17.14
N$273  (via drill 1 pad 1.68)
  other vias: 44.69,19.68
N$274  (via drill 1 pad 1.68)
  other vias: 44.69,22.23
N$275  (via drill 1 pad 1.68)
  other vias: 44.69,24.77
N$276  (via drill 1 pad 1.68)
  other vias: 44.69,27.3
N$277  (via drill 1 pad 1.68)
  other vias: 44.69,29.84
N$278  (via drill 1 pad 1.68)
  other vias: 44.69,32.38
N$279  (via drill 1 pad 1.68)
  other vias: 44.69,34.92
N$280  (via drill 1 pad 1.68)
  other vias: 44.69,37.47
N$281  (via drill 1 pad 1.68)
  other vias: 47.23,37.47
N$282  (via drill 1 pad 1.68)
  other vias: 47.23,34.92
N$283  (via drill 1 pad 1.68)
  other vias: 47.23,32.38
N$284  (via drill 1 pad 1.68)
  other vias: 47.23,29.84
N$285  (via drill 1 pad 1.68)
  other vias: 47.23,27.3
N$286  (via drill 1 pad 1.68)
  other vias: 47.23,24.77
N$287  (via drill 1 pad 1.68)
  other vias: 47.23,22.23
N$288  (via drill 1 pad 1.68)
  other vias: 47.23,19.68
N$289  (via drill 1 pad 1.68)
  other vias: 47.23,17.14
N$290  (via drill 1 pad 1.68)
  other vias: 47.23,14.61
N$291  (via drill 1 pad 1.68)
  other vias: 47.23,12.06
N$292  (via drill 1 pad 1.68)
  other vias: 49.77,12.06
N$293  (via drill 1 pad 1.68)
  other vias: 49.77,14.61
N$294  (via drill 1 pad 1.68)
  other vias: 49.77,17.14
N$295  (via drill 1 pad 1.68)
  other vias: 49.77,19.68
N$296  (via drill 1 pad 1.68)
  other vias: 49.77,22.23
N$297  (via drill 1 pad 1.68)
  other vias: 49.77,24.77
N$298  (via drill 1 pad 1.68)
  other vias: 49.77,27.3
N$299  (via drill 1 pad 1.68)
  other vias: 49.77,29.84
N$300  (via drill 1 pad 1.68)
  other vias: 49.77,32.38
N$301  (via drill 1 pad 1.68)
  other vias: 49.77,37.47
N$302  (via drill 1 pad 1.68)
  other vias: 49.77,34.92
N$303  (via drill 1 pad 1.68)
  other vias: 52.31,37.47
N$304  (via drill 1 pad 1.68)
  other vias: 52.31,34.92
N$305  (via drill 1 pad 1.68)
  other vias: 52.31,32.38
N$306  (via drill 1 pad 1.68)
  other vias: 52.31,29.84
N$307  (via drill 1 pad 1.68)
  other vias: 52.31,27.3
N$308  (via drill 1 pad 1.68)
  other vias: 52.31,24.77
N$309  (via drill 1 pad 1.68)
  other vias: 52.31,22.23
N$310  (via drill 1 pad 1.68)
  other vias: 52.31,19.68
N$311  (via drill 1 pad 1.68)
  other vias: 52.31,17.14
N$312  (via drill 1 pad 1.68)
  other vias: 52.31,14.61
N$313  (via drill 1 pad 1.68)
  other vias: 52.31,12.06
N$314  (via drill 1 pad 1.68)
  other vias: 54.85,12.06
N$315  (via drill 1 pad 1.68)
  other vias: 54.85,14.61
N$316  (via drill 1 pad 1.68)
  other vias: 54.85,17.14
N$317  (via drill 1 pad 1.68)
  other vias: 54.85,19.68
N$318  (via drill 1 pad 1.68)
  other vias: 54.85,22.23
N$319  (via drill 1 pad 1.68)
  other vias: 54.85,24.77
N$320  (via drill 1 pad 1.68)
  other vias: 54.85,27.3
N$321  (via drill 1 pad 1.68)
  other vias: 54.85,29.84
N$322  (via drill 1 pad 1.68)
  other vias: 54.85,32.38
N$323  (via drill 1 pad 1.68)
  other vias: 54.85,34.92
N$324  (via drill 1 pad 1.68)
  other vias: 54.85,37.47
N$325  (via drill 1 pad 1.68)
  other vias: 57.39,37.47
N$326  (via drill 1 pad 1.68)
  other vias: 57.39,34.92
N$327  (via drill 1 pad 1.68)
  other vias: 57.39,32.38
N$328  (via drill 1 pad 1.68)
  other vias: 57.39,29.84
N$329  (via drill 1 pad 1.68)
  other vias: 57.39,27.3
N$330  (via drill 1 pad 1.68)
  other vias: 57.39,24.77
N$331  (via drill 1 pad 1.68)
  other vias: 57.39,22.23
N$332  (via drill 1 pad 1.68)
  other vias: 57.39,19.68
N$333  (via drill 1 pad 1.68)
  other vias: 57.39,17.14
N$334  (via drill 1 pad 1.68)
  other vias: 57.39,14.61
N$335  (via drill 1 pad 1.68)
  other vias: 57.39,12.06
N$336  (via drill 1 pad 1.68)
  other vias: 59.93,12.06
N$337  (via drill 1 pad 1.68)
  other vias: 59.93,14.61
N$338  (via drill 1 pad 1.68)
  other vias: 59.93,17.14
N$339  (via drill 1 pad 1.68)
  other vias: 59.93,19.68
N$340  (via drill 1 pad 1.68)
  other vias: 59.93,22.23
N$341  (via drill 1 pad 1.68)
  other vias: 59.93,24.77
N$342  (via drill 1 pad 1.68)
  other vias: 59.93,27.3
N$343  (via drill 1 pad 1.68)
  other vias: 59.93,29.84
N$344  (via drill 1 pad 1.68)
  other vias: 59.93,32.38
N$345  (via drill 1 pad 1.68)
  other vias: 59.93,34.92
N$346  (via drill 1 pad 1.68)
  other vias: 59.93,37.47
N$347  (via drill 1 pad 1.68)
  other vias: 62.47,12.06
N$348  (via drill 1 pad 1.68)
  other vias: 62.47,14.61
N$349  (via drill 1 pad 1.68)
  other vias: 62.47,17.14
N$350  (via drill 1 pad 1.68)
  other vias: 62.47,19.68
N$351  (via drill 1 pad 1.68)
  other vias: 62.47,22.23
N$352  (via drill 1 pad 1.68)
  other vias: 62.47,24.77
N$353  (via drill 1 pad 1.68)
  other vias: 62.47,27.3
N$354  (via drill 1 pad 1.68)
  other vias: 62.47,29.84
N$355  (via drill 1 pad 1.68)
  other vias: 62.47,32.38
N$356  (via drill 1 pad 1.68)
  other vias: 62.47,34.92
N$357  (via drill 1 pad 1.68)
  other vias: 62.47,37.47
N$358  (via drill 1 pad 1.68)
  other vias: 62.47,40.01
N$359  (via drill 1 pad 1.68)
  other vias: 62.47,42.55
N$360  (via drill 1 pad 1.68)
  other vias: 65.01,42.55
N$361  (via drill 1 pad 1.68)
  other vias: 65.01,40.01
N$362  (via drill 1 pad 1.68)
  other vias: 65.01,37.47
N$363  (via drill 1 pad 1.68)
  other vias: 65.01,34.92
N$364  (via drill 1 pad 1.68)
  other vias: 65.01,32.38
N$365  (via drill 1 pad 1.68)
  other vias: 65.01,29.84
N$366  (via drill 1 pad 1.68)
  other vias: 65.01,27.3
N$367  (via drill 1 pad 1.68)
  other vias: 65.01,24.77
N$368  (via drill 1 pad 1.68)
  other vias: 65.01,22.23
N$369  (via drill 1 pad 1.68)
  other vias: 65.01,19.68
N$370  (via drill 1 pad 1.68)
  other vias: 65.01,17.14
N$371  (via drill 1 pad 1.68)
  other vias: 65.01,14.61
N$372  (via drill 1 pad 1.68)
  other vias: 65.01,12.06
N$374  (via drill 1 pad 1.68)
  other vias: 67.55,12.06
N$378  (via drill 1 pad 1.68)
  other vias: 67.55,14.61
N$379  (via drill 1 pad 1.68)
  other vias: 67.55,17.14
N$380  (via drill 1 pad 1.68)
  other vias: 67.55,19.68
N$383  (via drill 1 pad 1.68)
  other vias: 67.55,22.23
N$384  (via drill 1 pad 1.68)
  other vias: 67.55,24.77
N$385  (via drill 1 pad 1.68)
  other vias: 67.55,27.3
N$388  (via drill 1 pad 1.68)
  other vias: 67.55,29.84
N$389  (via drill 1 pad 1.68)
  other vias: 67.55,32.38
N$390  (via drill 1 pad 1.68)
  other vias: 67.55,34.92
N$395  (via drill 1 pad 1.68)
  other vias: 67.55,37.47
N$396  (via drill 1 pad 1.68)
  other vias: 67.55,40.01
N$399  (via drill 1 pad 1.68)
  other vias: 67.55,42.55
VRAW  (via drill 1 pad 1.68)
  Top 0.813: BB1.P9.5 BB1.P9.6 J3.3 J4.3 9.13,11.43 J16.8 J16.7 J16.6 J16.5 J16.4 J16.3 J16.2 J16.1 v11.04,33.66

### Text on the board
tPlace: P8 | 2 | 46 | 1 | 45 | GND | VDD3V3 | VDD5V | SYS5V | 2 | 46 | 1 | 45 | P9
bPlace: PC03